# Altium project roach2_project rev2.PrjPCB (part 11 of 13)

## Sheet ppc_ddr2_1.SchDoc: PowerPC DDR2 SDRAM Circuits
size A3; Date: DO NOT USE, RATHER USE PROJ OPTIONS; DrawnBy: DO NOT USE, RATHER USE PROJ OPTIONS; Engineer: DO NOT USE, RATHER USE PROJ OPTIONS; Organization: DO NOT USE, RATHER USE PROJ OPTIONS; DocumentNumber: DO NOT USE, RATHER USE PROJ OPTIONS; Revision: DO NOT USE, RATHER USE PROJ OPTIONS; SheetNumber: 9; SheetTotal: 29; SCH_Sheet_Filename: ppc_ddr2_1.SchDoc; CurrentTime: DO NOT USE, RATHER USE PROJ OPTIONS; Time: DO NOT USE, RATHER USE PROJ OPTIONS; DocumentFullPathAndName: DO NOT USE, RATHER USE PROJ OPTIONS; DocumentName: DO NOT USE, RATHER USE PROJ OPTIONS; ModifiedDate: DO NOT USE, RATHER USE PROJ OPTIONS; ImagePath: DO NOT USE, RATHER USE PROJ OPTIONS
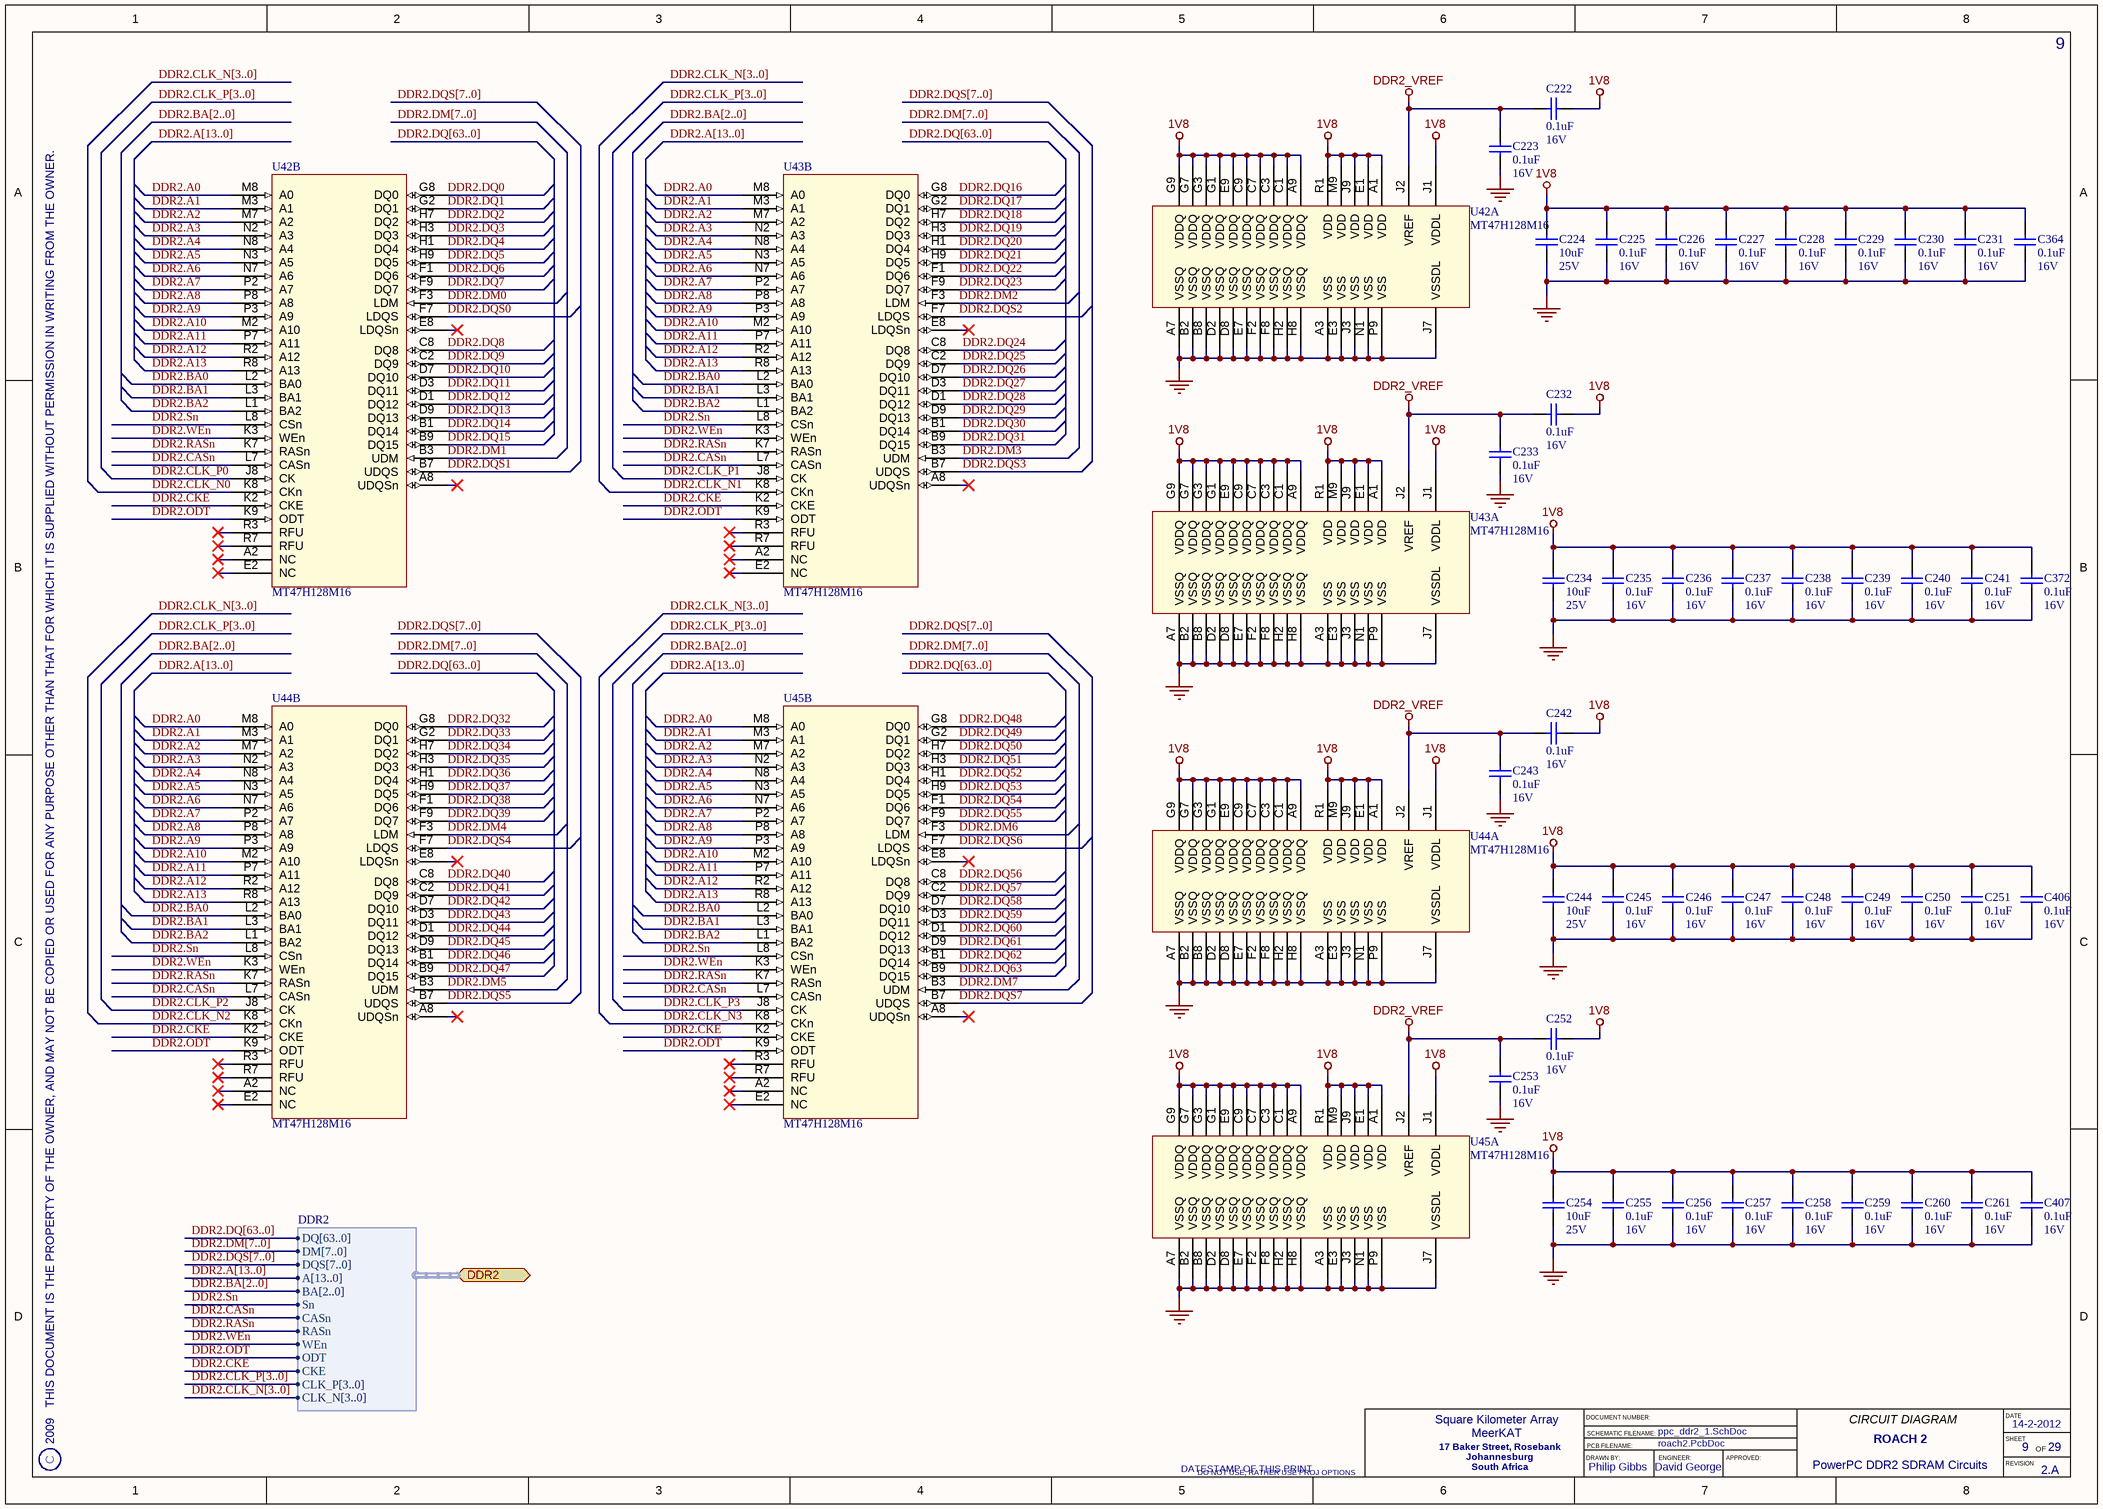
[diagram p23: ppc_ddr2_1.SchDoc]

### Parts
C222  Rating: 16V  [CAPC1005X60L]  (hidden comment: 0.1uF)
C223  Rating: 16V  [CAPC1005X60L]  (hidden comment: 0.1uF)
C224  Rating: 25V  [CAPC3225X200L]  (hidden comment: 10uF)
C225  Rating: 16V  [CAPC1005X60L]  (hidden comment: 0.1uF)
C226  Rating: 16V  [CAPC1005X60L]  (hidden comment: 0.1uF)
C227  Rating: 16V  [CAPC1005X60L]  (hidden comment: 0.1uF)
C228  Rating: 16V  [CAPC1005X60L]  (hidden comment: 0.1uF)
C229  Rating: 16V  [CAPC1005X60L]  (hidden comment: 0.1uF)
C230  Rating: 16V  [CAPC1005X60L]  (hidden comment: 0.1uF)
C231  Rating: 16V  [CAPC1005X60L]  (hidden comment: 0.1uF)
C232  Rating: 16V  [CAPC1005X60L]  (hidden comment: 0.1uF)
C233  Rating: 16V  [CAPC1005X60L]  (hidden comment: 0.1uF)
C234  Rating: 25V  [CAPC3225X200L]  (hidden comment: 10uF)
C235  Rating: 16V  [CAPC1005X60L]  (hidden comment: 0.1uF)
C236  Rating: 16V  [CAPC1005X60L]  (hidden comment: 0.1uF)
C237  Rating: 16V  [CAPC1005X60L]  (hidden comment: 0.1uF)
C238  Rating: 16V  [CAPC1005X60L]  (hidden comment: 0.1uF)
C239  Rating: 16V  [CAPC1005X60L]  (hidden comment: 0.1uF)
C240  Rating: 16V  [CAPC1005X60L]  (hidden comment: 0.1uF)
C241  Rating: 16V  [CAPC1005X60L]  (hidden comment: 0.1uF)
C242  Rating: 16V  [CAPC1005X60L]  (hidden comment: 0.1uF)
C243  Rating: 16V  [CAPC1005X60L]  (hidden comment: 0.1uF)
C244  Rating: 25V  [CAPC3225X200L]  (hidden comment: 10uF)
C245  Rating: 16V  [CAPC1005X60L]  (hidden comment: 0.1uF)
C246  Rating: 16V  [CAPC1005X60L]  (hidden comment: 0.1uF)
C247  Rating: 16V  [CAPC1005X60L]  (hidden comment: 0.1uF)
C248  Rating: 16V  [CAPC1005X60L]  (hidden comment: 0.1uF)
C249  Rating: 16V  [CAPC1005X60L]  (hidden comment: 0.1uF)
C250  Rating: 16V  [CAPC1005X60L]  (hidden comment: 0.1uF)
C251  Rating: 16V  [CAPC1005X60L]  (hidden comment: 0.1uF)
C252  Rating: 16V  [CAPC1005X60L]  (hidden comment: 0.1uF)
C253  Rating: 16V  [CAPC1005X60L]  (hidden comment: 0.1uF)
C254  Rating: 25V  [CAPC3225X200L]  (hidden comment: 10uF)
C255  Rating: 16V  [CAPC1005X60L]  (hidden comment: 0.1uF)
C256  Rating: 16V  [CAPC1005X60L]  (hidden comment: 0.1uF)
C257  Rating: 16V  [CAPC1005X60L]  (hidden comment: 0.1uF)
C258  Rating: 16V  [CAPC1005X60L]  (hidden comment: 0.1uF)
C259  Rating: 16V  [CAPC1005X60L]  (hidden comment: 0.1uF)
C260  Rating: 16V  [CAPC1005X60L]  (hidden comment: 0.1uF)
C261  Rating: 16V  [CAPC1005X60L]  (hidden comment: 0.1uF)
C364  Rating: 16V  [CAPC1005X60L]  (hidden comment: 0.1uF)
C372  Rating: 16V  [CAPC1005X60L]  (hidden comment: 0.1uF)
C406  Rating: 16V  [CAPC1005X60L]  (hidden comment: 0.1uF)
C407  Rating: 16V  [CAPC1005X60L]  (hidden comment: 0.1uF)
U42  MT47H128M16  [DDR2_BGA84]  (parts A,B of 2)
U43  MT47H128M16  [DDR2_BGA84]  (parts A,B of 2)
U44  MT47H128M16  [DDR2_BGA84]  (parts A,B of 2)
U45  MT47H128M16  [DDR2_BGA84]  (parts A,B of 2)

### Ports
DDR2 (harness DDR2)

### Harnesses
DDR2: DQ[63..0], DM[7..0], DQS[7..0], A[13..0], BA[2..0], Sn, CASn, RASn, WEn, ODT, CKE, CLK_P[3..0], CLK_N[3..0]

### Nets
1V8: C222.1 C224.2 C225.2 C226.2 C227.2 C228.2 C229.2 C230.2 C231.2 C232.1 C234.2 C235.2 C236.2 C237.2 C238.2 C239.2 C240.2 C241.2 C242.1 C244.2 C245.2 C246.2 C247.2 C248.2 C249.2 C250.2 C251.2 C252.1 C254.2 C255.2 C256.2 C257.2 C258.2 C259.2 C260.2 C261.2 C364.2 C372.2 C406.2 C407.2 U42.A1(VDD) U42.A9(VDDQ) U42.C1(VDDQ) U42.C3(VDDQ) U42.C7(VDDQ) U42.C9(VDDQ) U42.E1(VDD) U42.E9(VDDQ) U42.G1(VDDQ) U42.G3(VDDQ) U42.G7(VDDQ) U42.G9(VDDQ) U42.J1(VDDL) U42.J9(VDD) U42.M9(VDD) U42.R1(VDD) U43.A1(VDD) U43.A9(VDDQ) U43.C1(VDDQ) U43.C3(VDDQ) U43.C7(VDDQ) U43.C9(VDDQ) U43.E1(VDD) U43.E9(VDDQ) U43.G1(VDDQ) U43.G3(VDDQ) U43.G7(VDDQ) U43.G9(VDDQ) U43.J1(VDDL) U43.J9(VDD) U43.M9(VDD) U43.R1(VDD) U44.A1(VDD) U44.A9(VDDQ) U44.C1(VDDQ) U44.C3(VDDQ) U44.C7(VDDQ) U44.C9(VDDQ) U44.E1(VDD) U44.E9(VDDQ) U44.G1(VDDQ) U44.G3(VDDQ) U44.G7(VDDQ) U44.G9(VDDQ) U44.J1(VDDL) U44.J9(VDD) U44.M9(VDD) U44.R1(VDD) U45.A1(VDD) U45.A9(VDDQ) U45.C1(VDDQ) U45.C3(VDDQ) U45.C7(VDDQ) U45.C9(VDDQ) U45.E1(VDD) U45.E9(VDDQ) U45.G1(VDDQ) U45.G3(VDDQ) U45.G7(VDDQ) U45.G9(VDDQ) U45.J1(VDDL) U45.J9(VDD) U45.M9(VDD) U45.R1(VDD)
DDR2_VREF: C222.2 C223.2 C232.2 C233.2 C242.2 C243.2 C252.2 C253.2 U42.J2(VREF) U43.J2(VREF) U44.J2(VREF) U45.J2(VREF)
GND: C223.1 C224.1 C225.1 C226.1 C227.1 C228.1 C229.1 C230.1 C231.1 C233.1 C234.1 C235.1 C236.1 C237.1 C238.1 C239.1 C240.1 C241.1 C243.1 C244.1 C245.1 C246.1 C247.1 C248.1 C249.1 C250.1 C251.1 C253.1 C254.1 C255.1 C256.1 C257.1 C258.1 C259.1 C260.1 C261.1 C364.1 C372.1 C406.1 C407.1 U42.A3(VSS) U42.A7(VSSQ) U42.B2(VSSQ) U42.B8(VSSQ) U42.D2(VSSQ) U42.D8(VSSQ) U42.E3(VSS) U42.E7(VSSQ) U42.F2(VSSQ) U42.F8(VSSQ) U42.H2(VSSQ) U42.H8(VSSQ) U42.J3(VSS) U42.J7(VSSDL) U42.N1(VSS) U42.P9(VSS) U43.A3(VSS) U43.A7(VSSQ) U43.B2(VSSQ) U43.B8(VSSQ) U43.D2(VSSQ) U43.D8(VSSQ) U43.E3(VSS) U43.E7(VSSQ) U43.F2(VSSQ) U43.F8(VSSQ) U43.H2(VSSQ) U43.H8(VSSQ) U43.J3(VSS) U43.J7(VSSDL) U43.N1(VSS) U43.P9(VSS) U44.A3(VSS) U44.A7(VSSQ) U44.B2(VSSQ) U44.B8(VSSQ) U44.D2(VSSQ) U44.D8(VSSQ) U44.E3(VSS) U44.E7(VSSQ) U44.F2(VSSQ) U44.F8(VSSQ) U44.H2(VSSQ) U44.H8(VSSQ) U44.J3(VSS) U44.J7(VSSDL) U44.N1(VSS) U44.P9(VSS) U45.A3(VSS) U45.A7(VSSQ) U45.B2(VSSQ) U45.B8(VSSQ) U45.D2(VSSQ) U45.D8(VSSQ) U45.E3(VSS) U45.E7(VSSQ) U45.F2(VSSQ) U45.F8(VSSQ) U45.H2(VSSQ) U45.H8(VSSQ) U45.J3(VSS) U45.J7(VSSDL) U45.N1(VSS) U45.P9(VSS)
DDR2.A0: U42.M8(A0) U43.M8(A0) U44.M8(A0) U45.M8(A0)
DDR2.A1: U42.M3(A1) U43.M3(A1) U44.M3(A1) U45.M3(A1)
DDR2.A2: U42.M7(A2) U43.M7(A2) U44.M7(A2) U45.M7(A2)
DDR2.A3: U42.N2(A3) U43.N2(A3) U44.N2(A3) U45.N2(A3)
DDR2.A4: U42.N8(A4) U43.N8(A4) U44.N8(A4) U45.N8(A4)
DDR2.A5: U42.N3(A5) U43.N3(A5) U44.N3(A5) U45.N3(A5)
DDR2.A6: U42.N7(A6) U43.N7(A6) U44.N7(A6) U45.N7(A6)
DDR2.A7: U42.P2(A7) U43.P2(A7) U44.P2(A7) U45.P2(A7)
DDR2.A8: U42.P8(A8) U43.P8(A8) U44.P8(A8) U45.P8(A8)
DDR2.A9: U42.P3(A9) U43.P3(A9) U44.P3(A9) U45.P3(A9)
DDR2.A10: U42.M2(A10) U43.M2(A10) U44.M2(A10) U45.M2(A10)
DDR2.A11: U42.P7(A11) U43.P7(A11) U44.P7(A11) U45.P7(A11)
DDR2.A12: U42.R2(A12) U43.R2(A12) U44.R2(A12) U45.R2(A12)
DDR2.A13: U42.R8(A13) U43.R8(A13) U44.R8(A13) U45.R8(A13)
DDR2.BA0: U42.L2(BA0) U43.L2(BA0) U44.L2(BA0) U45.L2(BA0)
DDR2.BA1: U42.L3(BA1) U43.L3(BA1) U44.L3(BA1) U45.L3(BA1)
DDR2.BA2: U42.L1(BA2) U43.L1(BA2) U44.L1(BA2) U45.L1(BA2)
DDR2.CASn: U42.L7(CASn) U43.L7(CASn) U44.L7(CASn) U45.L7(CASn) ; port DDR2.CASn
DDR2.CKE: U42.K2(CKE) U43.K2(CKE) U44.K2(CKE) U45.K2(CKE) ; port DDR2.CKE
DDR2.CLK_N0: U42.K8(CKn)
DDR2.CLK_N1: U43.K8(CKn)
DDR2.CLK_N2: U44.K8(CKn)
DDR2.CLK_N3: U45.K8(CKn)
DDR2.CLK_P0: U42.J8(CK)
DDR2.CLK_P1: U43.J8(CK)
DDR2.CLK_P2: U44.J8(CK)
DDR2.CLK_P3: U45.J8(CK)
DDR2.DM0: U42.F3(LDM)
DDR2.DM1: U42.B3(UDM)
DDR2.DM2: U43.F3(LDM)
DDR2.DM3: U43.B3(UDM)
DDR2.DM4: U44.F3(LDM)
DDR2.DM5: U44.B3(UDM)
DDR2.DM6: U45.F3(LDM)
DDR2.DM7: U45.B3(UDM)
DDR2.DQ0: U42.G8(DQ0)
DDR2.DQ1: U42.G2(DQ1)
DDR2.DQ2: U42.H7(DQ2)
DDR2.DQ3: U42.H3(DQ3)
DDR2.DQ4: U42.H1(DQ4)
DDR2.DQ5: U42.H9(DQ5)
DDR2.DQ6: U42.F1(DQ6)
DDR2.DQ7: U42.F9(DQ7)
DDR2.DQ8: U42.C8(DQ8)
DDR2.DQ9: U42.C2(DQ9)
DDR2.DQ10: U42.D7(DQ10)
DDR2.DQ11: U42.D3(DQ11)
DDR2.DQ12: U42.D1(DQ12)
DDR2.DQ13: U42.D9(DQ13)
DDR2.DQ14: U42.B1(DQ14)
DDR2.DQ15: U42.B9(DQ15)
DDR2.DQ16: U43.G8(DQ0)
DDR2.DQ17: U43.G2(DQ1)
DDR2.DQ18: U43.H7(DQ2)
DDR2.DQ19: U43.H3(DQ3)
DDR2.DQ20: U43.H1(DQ4)
DDR2.DQ21: U43.H9(DQ5)
DDR2.DQ22: U43.F1(DQ6)
DDR2.DQ23: U43.F9(DQ7)
DDR2.DQ24: U43.C8(DQ8)
DDR2.DQ25: U43.C2(DQ9)
DDR2.DQ26: U43.D7(DQ10)
DDR2.DQ27: U43.D3(DQ11)
DDR2.DQ28: U43.D1(DQ12)
DDR2.DQ29: U43.D9(DQ13)
DDR2.DQ30: U43.B1(DQ14)
DDR2.DQ31: U43.B9(DQ15)
DDR2.DQ32: U44.G8(DQ0)
DDR2.DQ33: U44.G2(DQ1)
DDR2.DQ34: U44.H7(DQ2)
DDR2.DQ35: U44.H3(DQ3)
DDR2.DQ36: U44.H1(DQ4)
DDR2.DQ37: U44.H9(DQ5)
DDR2.DQ38: U44.F1(DQ6)
DDR2.DQ39: U44.F9(DQ7)
DDR2.DQ40: U44.C8(DQ8)
DDR2.DQ41: U44.C2(DQ9)
DDR2.DQ42: U44.D7(DQ10)
DDR2.DQ43: U44.D3(DQ11)
DDR2.DQ44: U44.D1(DQ12)
DDR2.DQ45: U44.D9(DQ13)
DDR2.DQ46: U44.B1(DQ14)
DDR2.DQ47: U44.B9(DQ15)
DDR2.DQ48: U45.G8(DQ0)
DDR2.DQ49: U45.G2(DQ1)
DDR2.DQ50: U45.H7(DQ2)
DDR2.DQ51: U45.H3(DQ3)
DDR2.DQ52: U45.H1(DQ4)
DDR2.DQ53: U45.H9(DQ5)
DDR2.DQ54: U45.F1(DQ6)
DDR2.DQ55: U45.F9(DQ7)
DDR2.DQ56: U45.C8(DQ8)
DDR2.DQ57: U45.C2(DQ9)
DDR2.DQ58: U45.D7(DQ10)
DDR2.DQ59: U45.D3(DQ11)
DDR2.DQ60: U45.D1(DQ12)
DDR2.DQ61: U45.D9(DQ13)
DDR2.DQ62: U45.B1(DQ14)
DDR2.DQ63: U45.B9(DQ15)
DDR2.DQS0: U42.F7(LDQS)
DDR2.DQS1: U42.B7(UDQS)
DDR2.DQS2: U43.F7(LDQS)
DDR2.DQS3: U43.B7(UDQS)
DDR2.DQS4: U44.F7(LDQS)
DDR2.DQS5: U44.B7(UDQS)
DDR2.DQS6: U45.F7(LDQS)
DDR2.DQS7: U45.B7(UDQS)
DDR2.ODT: U42.K9(ODT) U43.K9(ODT) U44.K9(ODT) U45.K9(ODT) ; port DDR2.ODT
DDR2.RASn: U42.K7(RASn) U43.K7(RASn) U44.K7(RASn) U45.K7(RASn) ; port DDR2.RASn
DDR2.Sn: U42.L8(CSn) U43.L8(CSn) U44.L8(CSn) U45.L8(CSn) ; port DDR2.Sn
DDR2.WEn: U42.K3(WEn) U43.K3(WEn) U44.K3(WEn) U45.K3(WEn) ; port DDR2.WEn

Not connected (* = marked no-connect by the designer): U42 A2(NC)* A8(UDQSn)* E2(NC)* E8(LDQSn)* R3(RFU)* R7(RFU)*; U43 A2(NC)* A8(UDQSn)* E2(NC)* E8(LDQSn)* R3(RFU)* R7(RFU)*; U44 A2(NC)* A8(UDQSn)* E2(NC)* E8(LDQSn)* R3(RFU)* R7(RFU)*; U45 A2(NC)* A8(UDQSn)* E2(NC)* E8(LDQSn)* R3(RFU)* R7(RFU)*

### Buses and harness runs
bus DDR2.A[13..0]
bus DDR2.BA[2..0]
bus DDR2.CLK_N[3..0]
bus DDR2.CLK_P[3..0]
bus DDR2.DM[7..0]
bus DDR2.DQ[63..0]
bus DDR2.DQS[7..0]

### Notes on the sheet
- 2009   THIS DOCUMENT IS THE PROPERTY OF THE OWNER, AND MAY NOT BE COPIED OR USED FOR ANY PURPOSE OTHER THAN THAT FOR WHICH IT IS SUPPLIED WITHOUT PERMISSION IN WRITING FROM THE OWNER.
- C
- DATESTAMP OF THIS PRINT
- DRAWN BY:
- DOCUMENT NUMBER:
- SCHEMATIC FILENAME:
- PCB FILENAME:
- ENGINEER:
- APPROVED:
- CIRCUIT DIAGRAM
- DATE
- SHEET
- REVISION
- OF

### Library data of the parts
C222 C223 C225-C233 C235-C243 C245-C253 C255-C261 C364 C372 C406 C407 = CAP-CER-1: as C181 on sheet mgt_breakout; POD number: CAP-CER-1; Value: 0.1uF; RoHS: Y; Sort Value: 0.1; Category: Capacitors; Subcategory: Ceramic
C224 C234 C244 C254 = CAP-CER-5: as C679 on sheet v6_net; POD number: CAP-CER-5; Value: 10uF; RoHS: Y; Sort Value: 100; Category: Capacitors; Subcategory: Ceramic
U42-U45 = IC-MEM-2: 2Gb, x16, BGA84 DDR2 SDRAM IC; Manufacturer: Micron; POD number: IC-MEM-2; PartNum: MT47H128M16; RoHS: Y; Category: IC; Subcategory: Memory

## Sheet misc.SchDoc: Miscellaneous Design Items
size A3; Date: DO NOT USE, RATHER USE PROJ OPTIONS; DrawnBy: DO NOT USE, RATHER USE PROJ OPTIONS; Engineer: DO NOT USE, RATHER USE PROJ OPTIONS; Organization: DO NOT USE, RATHER USE PROJ OPTIONS; DocumentNumber: DO NOT USE, RATHER USE PROJ OPTIONS; Revision: DO NOT USE, RATHER USE PROJ OPTIONS; SheetNumber: 27; SheetTotal: 29; SCH_Sheet_Filename: misc.SchDoc; CurrentTime: DO NOT USE, RATHER USE PROJ OPTIONS; Time: DO NOT USE, RATHER USE PROJ OPTIONS; DocumentFullPathAndName: DO NOT USE, RATHER USE PROJ OPTIONS; DocumentName: DO NOT USE, RATHER USE PROJ OPTIONS; ModifiedDate: DO NOT USE, RATHER USE PROJ OPTIONS; ImagePath: DO NOT USE, RATHER USE PROJ OPTIONS
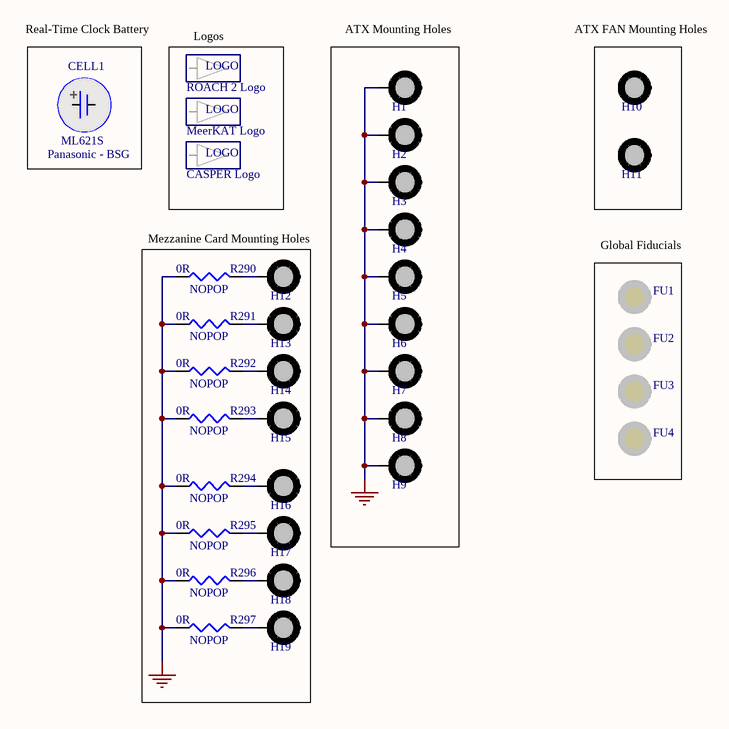
[diagram p24: misc.SchDoc]

### Parts
CELL1  Manufacturer: Panasonic - BSG  (hidden comment: ML621S)  (mechanical)
FU1  FIDUCIAL  [FIDUCIAL_1MM]  (value not drawn)  (no BOM)
FU2  FIDUCIAL  [FIDUCIAL_1MM]  (value not drawn)  (no BOM)
FU3  FIDUCIAL  [FIDUCIAL_1MM]  (value not drawn)  (no BOM)
FU4  FIDUCIAL  [FIDUCIAL_1MM]  (value not drawn)  (no BOM)
H1  MH_ATX  [MH_ATX]  (value not drawn)  (no BOM)
H2  MH_ATX  [MH_ATX]  (value not drawn)  (no BOM)
H3  MH_ATX  [MH_ATX]  (value not drawn)  (no BOM)
H4  MH_ATX  [MH_ATX]  (value not drawn)  (no BOM)
H5  MH_ATX  [MH_ATX]  (value not drawn)  (no BOM)
H6  MH_ATX  [MH_ATX]  (value not drawn)  (no BOM)
H7  MH_ATX  [MH_ATX]  (value not drawn)  (no BOM)
H8  MH_ATX  [MH_ATX]  (value not drawn)  (no BOM)
H9  MH_ATX  [MH_ATX]  (value not drawn)  (no BOM)
H10  MH_NC  [MH_FANATX]  (value not drawn)  (no BOM)
H11  MH_NC  [MH_FANATX]  (value not drawn)  (no BOM)
H12  MH_ATX  [MH_ATX]  (value not drawn)  (no BOM)
H13  MH_ATX  [MH_ATX]  (value not drawn)  (no BOM)
H14  MH_ATX  [MH_ATX]  (value not drawn)  (no BOM)
H15  MH_ATX  [MH_ATX]  (value not drawn)  (no BOM)
H16  MH_ATX  [MH_ATX]  (value not drawn)  (no BOM)
H17  MH_ATX  [MH_ATX]  (value not drawn)  (no BOM)
H18  MH_ATX  [MH_ATX]  (value not drawn)  (no BOM)
H19  MH_ATX  [MH_ATX]  (value not drawn)  (no BOM)
LOGO1  ROACH 2 Logo  [ROACH2_LOGO]  (no BOM)
LOGO2  MeerKAT Logo  [MEERKAT_LOGO]  (no BOM)
LOGO3  CASPER Logo  [CASPER_LOGO]  (no BOM)
R290  0R  [RESC1005X40L]
R291  0R  [RESC1005X40L]
R292  0R  [RESC1005X40L]
R293  0R  [RESC1005X40L]
R294  0R  [RESC1005X40L]
R295  0R  [RESC1005X40L]
R296  0R  [RESC1005X40L]
R297  0R  [RESC1005X40L]

### Nets
GND: H1.1 H2.1 H3.1 H4.1 H5.1 H6.1 H7.1 H8.1 H9.1 R290.1 R291.1 R292.1 R293.1 R294.1 R295.1 R296.1 R297.1
NetH12_1: H12.1 R290.2
NetH13_1: H13.1 R291.2
NetH14_1: H14.1 R292.2
NetH15_1: H15.1 R293.2
NetH16_1: H16.1 R294.2
NetH17_1: H17.1 R295.2
NetH18_1: H18.1 R296.2
NetH19_1: H19.1 R297.2

### Notes on the sheet
- Real-Time Clock Battery
- (near LOGO1) Logos
- (near H1) ATX Mounting Holes
- (near H10) ATX FAN Mounting Holes
- Mezzanine Card Mounting Holes
- (near FU1) Global Fiducials
- (near R290) NOPOP
- (near R291) NOPOP
- (near R292) NOPOP
- (near R293) NOPOP
- (near R294) NOPOP
- (near R295) NOPOP
- (near R296) NOPOP
- (near R297) NOPOP
- 2009   THIS DOCUMENT IS THE PROPERTY OF THE OWNER, AND MAY NOT BE COPIED OR USED FOR ANY PURPOSE OTHER THAN THAT FOR WHICH IT IS SUPPLIED WITHOUT PERMISSION IN WRITING FROM THE OWNER.
- C
- DATESTAMP OF THIS PRINT
- DRAWN BY:
- DOCUMENT NUMBER:
- SCHEMATIC FILENAME:
- PCB FILENAME:
- ENGINEER:
- APPROVED:
- CIRCUIT DIAGRAM
- DATE
- SHEET
- REVISION
- OF

### Library data of the parts
CELL1 = ELMECH-BAT-0: 3V,  6.8mm Mangenese Lithium Battery; POD number: ELMECH-BAT-0; PartNum: ML621S; RoHS: Y; Value: 3V; Category: ELMECH; Subcategory: Batteries
FU1-FU4 = MECH-FU-1: 1mm Fiducial mark; POD number: MECH-FU-1; RoHS: Y; Category: MECH; Subcategory: Fiducial
H1-H9 H12-H19 = ELMECH-MH-0: 3.81mm Diameter, ATX mounting hole; POD number: ELMECH-MH-0; RoHS: Y; Category: ELMECH; Subcategory: Mounting Holes
H10 H11 = ELMECH-MH-1: 3.2mm Diameter, Unplated, Floating mounting Hole; POD number: ELMECH-MH-1; RoHS: Y; Category: ELMECH; Subcategory: Mounting Holes
LOGO1 = GRAPH-LOGO-0: POD number: GRAPH-LOGO-0; RoHS: Y; Category: GRAPH; Subcategory: Logo
LOGO2 = GRAPH-LOGO-1: POD number: GRAPH-LOGO-1; RoHS: Y; Category: GRAPH; Subcategory: Logo
LOGO3 = GRAPH-LOGO-2: POD number: GRAPH-LOGO-2; RoHS: Y; Category: GRAPH; Subcategory: Logo
R290-R297 = RES-TF-0: as R223 on sheet v6_net; POD number: RES-TF-0; Value: 0R; Sort Value: 0; Category: Resistors; Subcategory: ThickFilm; HelpURL: *.pdf

## Sheet LEDs.SchDoc: Hardware Monitoring
size A3; Date: DO NOT USE, RATHER USE PROJ OPTIONS; DrawnBy: DO NOT USE, RATHER USE PROJ OPTIONS; Engineer: DO NOT USE, RATHER USE PROJ OPTIONS; Organization: DO NOT USE, RATHER USE PROJ OPTIONS; DocumentNumber: DO NOT USE, RATHER USE PROJ OPTIONS; Revision: DO NOT USE, RATHER USE PROJ OPTIONS; SheetNumber: 29; SheetTotal: 29; SCH_Sheet_Filename: LEDs.SchDoc; CurrentTime: DO NOT USE, RATHER USE PROJ OPTIONS; Time: DO NOT USE, RATHER USE PROJ OPTIONS; DocumentFullPathAndName: DO NOT USE, RATHER USE PROJ OPTIONS; DocumentName: DO NOT USE, RATHER USE PROJ OPTIONS; ModifiedDate: DO NOT USE, RATHER USE PROJ OPTIONS; ImagePath: DO NOT USE, RATHER USE PROJ OPTIONS
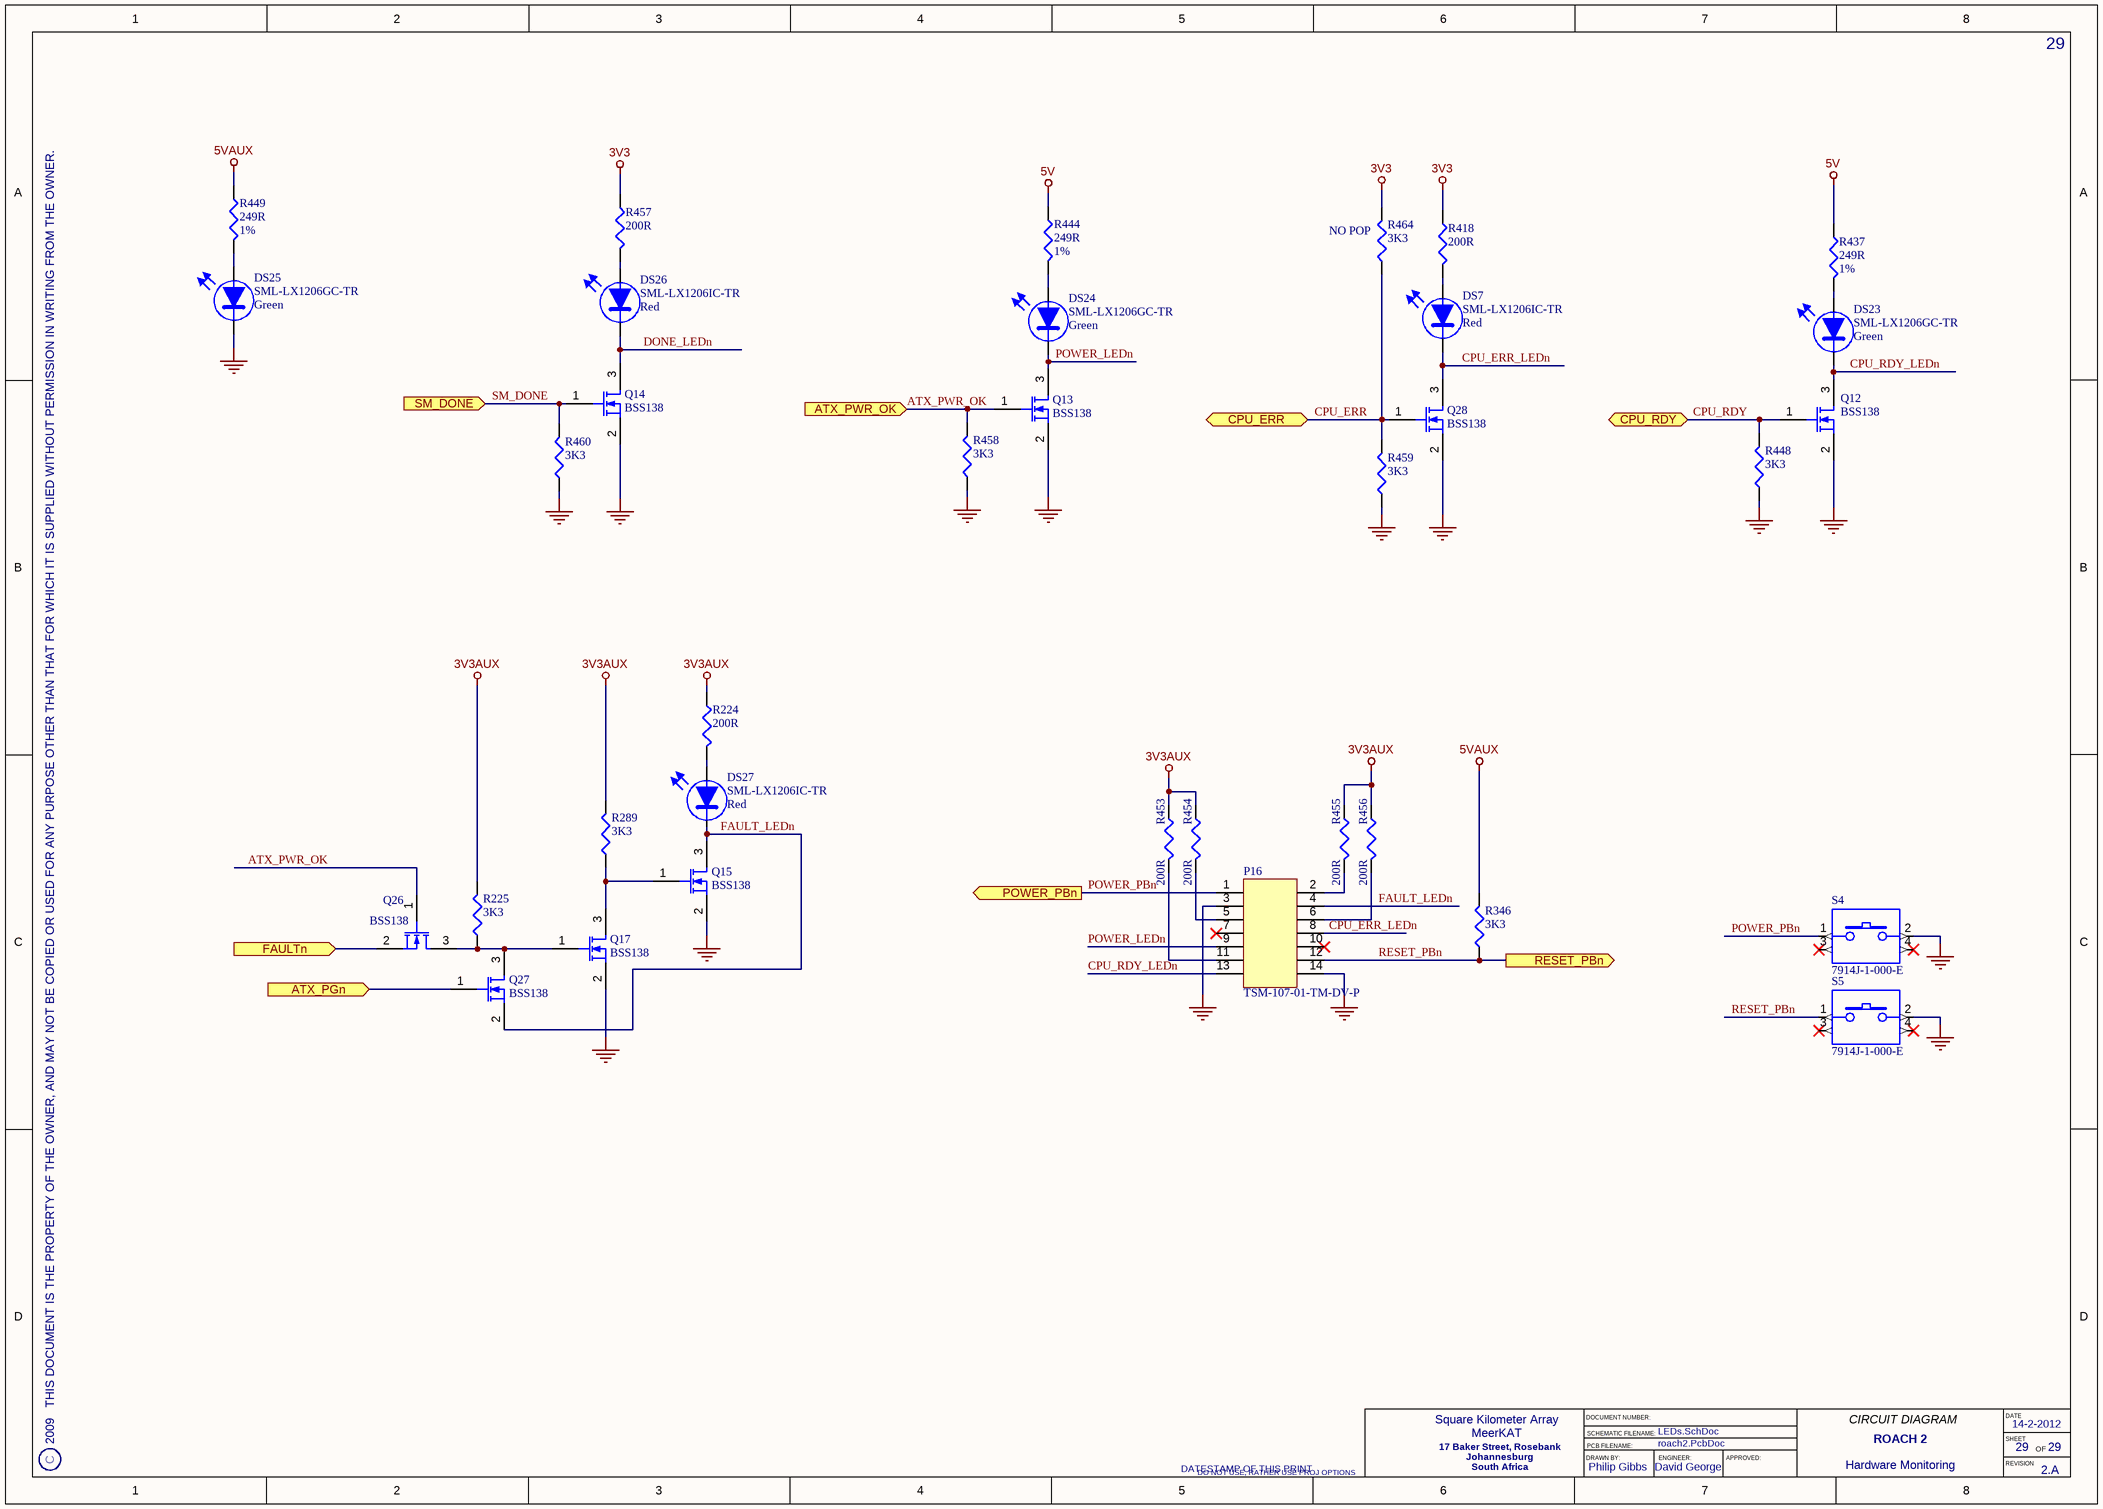
[diagram p25: LEDs.SchDoc]

### Parts
DS7  SML-LX1206IC-TR  Colour: Red  [LEDC3216X120N]
DS23  SML-LX1206GC-TR  Colour: Green  [LEDC3216X120N]
DS24  SML-LX1206GC-TR  Colour: Green  [LEDC3216X120N]
DS25  SML-LX1206GC-TR  Colour: Green  [LEDC3216X120N]
DS26  SML-LX1206IC-TR  Colour: Red  [LEDC3216X120N]
DS27  SML-LX1206IC-TR  Colour: Red  [LEDC3216X120N]
P16  TSM-107-01-TM-DV-P  [SAMTEC_TSM-107-01-TM-DV-P]
Q12  BSS138  [SOT95P245X110-3N]
Q13  BSS138  [SOT95P245X110-3N]
Q14  BSS138  [SOT95P245X110-3N]
Q15  BSS138  [SOT95P245X110-3N]
Q17  BSS138  [SOT95P245X110-3N]
Q26  BSS138  [SOT95P245X110-3N]
Q27  BSS138  [SOT95P245X110-3N]
Q28  BSS138  [SOT95P245X110-3N]
R224  200R  [RESC1005X40L]
R225  3K3  [RESC1005X40L]
R289  3K3  [RESC1005X40L]
R346  3K3  [RESC1005X40L]
R418  200R  [RESC1005X40L]
R437  Tolerance: 1%  [RESC1005X40L]  (hidden comment: 249R)
R444  Tolerance: 1%  [RESC1005X40L]  (hidden comment: 249R)
R448  3K3  [RESC1005X40L]
R449  Tolerance: 1%  [RESC1005X40L]  (hidden comment: 249R)
R453  200R  [RESC1005X40L]
R454  200R  [RESC1005X40L]
R455  200R  [RESC1005X40L]
R456  200R  [RESC1005X40L]
R457  200R  [RESC1005X40L]
R458  3K3  [RESC1005X40L]
R459  3K3  [RESC1005X40L]
R460  3K3  [RESC1005X40L]
R464  3K3  [RESC1005X40L]
S4  7914J-1-000-E  [7914J-X-XXX-X]
S5  7914J-1-000-E  [7914J-X-XXX-X]

### Ports
ATX_PGn (in), ATX_PWR_OK (in), CPU_ERR (bidir), CPU_RDY (bidir), FAULTn (in), POWER_PBn (out), RESET_PBn (out), SM_DONE (in)

### Nets
3V3: R418.1 R457.1 R464.2
3V3AUX: R224.1 R225.2 R289.2 R453.1 R454.1 R455.1 R456.1
5V: R437.1 R444.1
5VAUX: R346.2 R449.1
GND: DS25.1(K) P16.3 P16.14 Q12.2(S) Q13.2(S) Q14.2(S) Q15.2(S) Q17.2(S) Q28.2(S) R448.1 R458.1 R459.1 R460.1 S4.2 S5.2
ATX_PGn: Q27.1(G) ; port ATX_PGn
ATX_PWR_OK: Q13.1(G) Q26.1(G) R458.2 ; port ATX_PWR_OK
CPU_ERR: Q28.1(G) R459.2 R464.1 ; port CPU_ERR
CPU_ERR_LEDn: DS7.1(K) P16.8 Q28.3(D)
CPU_RDY: Q12.1(G) R448.2 ; port CPU_RDY
CPU_RDY_LEDn: DS23.1(K) P16.13 Q12.3(D)
DONE_LEDn: DS26.1(K) Q14.3(D)
FAULT_LEDn: DS27.1(K) P16.4 Q15.3(D) Q27.2(S)
FAULTn: Q26.2(S) ; port FAULTn
POWER_LEDn: DS24.1(K) P16.9 Q13.3(D)
POWER_PBn: P16.1 S4.1 ; port POWER_PBn
RESET_PBn: P16.12 R346.1 S5.1 ; port RESET_PBn
SM_DONE: Q14.1(G) R460.2 ; port SM_DONE
NetDS7_2: DS7.2(A) R418.2
NetDS23_2: DS23.2(A) R437.2
NetDS24_2: DS24.2(A) R444.2
NetDS25_2: DS25.2(A) R449.2
NetDS26_2: DS26.2(A) R457.2
NetDS27_2: DS27.2(A) R224.2
NetP16_2: P16.2 R455.2
NetP16_5: P16.5 R454.2
NetP16_6: P16.6 R456.2
NetP16_11: P16.11 R453.2
NetQ15_1: Q15.1(G) Q17.3(D) R289.1
NetQ17_1: Q17.1(G) Q26.3(D) Q27.3(D) R225.1

Not connected (* = marked no-connect by the designer): P16 7* 10*; S4 3* 4*; S5 3* 4*

### Notes on the sheet
- (near R464) NO POP
- 2009   THIS DOCUMENT IS THE PROPERTY OF THE OWNER, AND MAY NOT BE COPIED OR USED FOR ANY PURPOSE OTHER THAN THAT FOR WHICH IT IS SUPPLIED WITHOUT PERMISSION IN WRITING FROM THE OWNER.
- C
- DATESTAMP OF THIS PRINT
- DRAWN BY:
- DOCUMENT NUMBER:
- SCHEMATIC FILENAME:
- PCB FILENAME:
- ENGINEER:
- APPROVED:
- CIRCUIT DIAGRAM
- DATE
- SHEET
- REVISION
- OF

### Library data of the parts
DS7 DS26 DS27 = OPTO-LED-1: Red, Surface mount, LED, 1206; Manufacturer: LUMEX; Vdrop: 2V; Rating: 20mA; POD number: OPTO-LED-1; PartNum: SML-LX1206IC-TR; RoHS: Y; Category: OPTO; Subcategory: LED
DS23-DS25 = OPTO-LED-0: as DS9-DS12 on sheet v6_net; POD number: OPTO-LED-0; PartNum: SML-LX1206GC-TR; RoHS: Y; Category: OPTO; Subcategory: LED
P16 = CONN-PCB-16: 2x7, 2.54 mm Pitch, Male Header; Manufacturer: SAMTEC; POD number: CONN-PCB-16; PartNum: TSM-107-01-TM-DV-P; RoHS: Y; Category: CONN; Subcategory: PCB
Q12-Q15 Q17 Q26-Q28 = TRANS-NFET-0: as Q4 on sheet mgt_breakout; POD number: TRANS-NFET-0; PartNum: BSS138; RoHS: Y; Category: TRANS; Subcategory: NFET
R224 R418 R453-R457 = RES-TF-19: 200R, 1.1mm x 0.5mm, Thick Film Resistor; Manufacturer: ROYALOHM; PartNum: 0402WGF0201T1E; Tolerance: 1%; Rating: 0.0625W; POD number: RES-TF-19; Value: 200R; Sort Value: 200; Category: Resistors; Subcategory: ThickFilm; HelpURL: *.pdf
R225 R289 R346 R448 R458-R460 R464 = RES-TF-7: 3K3, 1.1mm x 0.5mm, Thick Film Resistor; Manufacturer: ROYALOHM; PartNum: 0402WGJ0332T1E; Tolerance: 5%; Rating: 0.0625W; POD number: RES-TF-7; Value: 3K3; Sort Value: 3300; Category: Resistors; Subcategory: ThickFilm; HelpURL: *.pdf
R437 R444 R449 = RES-TF-15: 249R, 1.1mm x 0.5mm, Thick Film Resistor; Manufacturer: ROYALOHM; PartNum: 0402WGF2490T1E; Rating: 0.0625W; POD number: RES-TF-15; Value: 249R; Sort Value: 249; Category: Resistors; Subcategory: ThickFilm; HelpURL: *.pdf
S4 S5 = ELMECH-SW-1: 4mm, Surface mount, Sealed Key Switch; Manufacturer: BOURNS; POD number: ELMECH-SW-1; PartNum: 7914J-1-000-E; RoHS: Y; Category: ELMECH; Subcategory: Switches